# EAGLE design 5VPowerBoard (EAGLE 8.5.0)
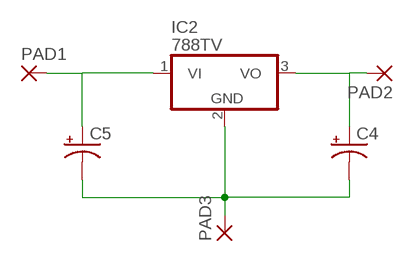
[diagram p0: schematic, sheet 1]

## Parts
C4  CPOL-USE2.5-7  [E2,5-7]
C5  CPOL-USE2.5-7  [E2,5-7]
IC2  788TV  [TO220V]
PAD1  3,81/1,4  [3,81/1,4]
PAD2  3,81/1,4  [3,81/1,4]
PAD3  3,81/1,4  [3,81/1,4]

## Nets
N$1: C4.- C5.- IC2.2(GND) PAD3.1(P)
VDD: C5.+ IC2.1(VI) PAD1.1(P)
VSW: C4.+ IC2.3(VO) PAD2.1(P)

## Library data of the parts
C4 C5 = rcl:CPOL-US: POLARIZED CAPACITOR, American symbol; SPICEPREFIX: C
IC2 = linear:78*: Positive VOLTAGE REGULATOR Source: http://cache.national.com/ds/LM/LM78L05.pdf http://www.fairchildsemi.com/ds/LM/LM7805.pdf
PAD1-PAD3 = wirepad:3,81/1,4: THROUGH-HOLE PAD

## Board
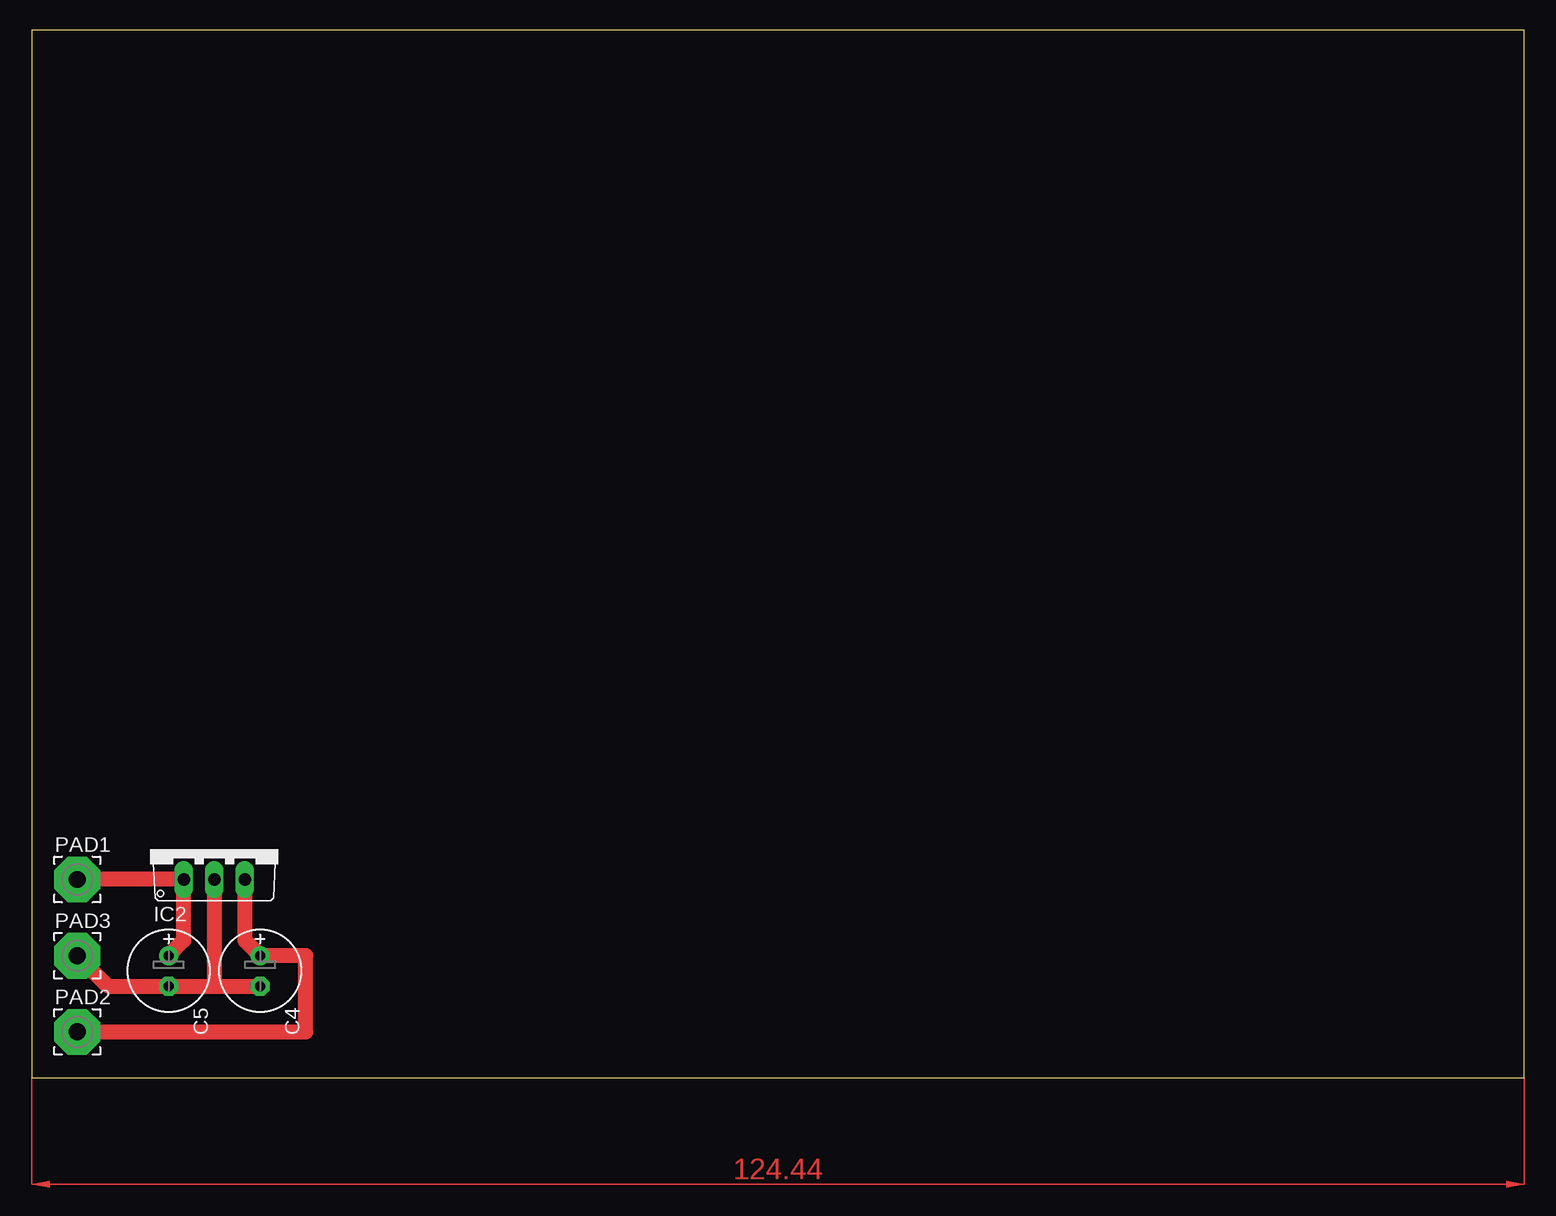
[diagram p1: board, top side]

Size 124.44 x 87.3 mm. Coordinates in mm from the lower left corner, seen from the top.
Outline: 0,0 124.44,0 124.44,87.3 0,87.3 0,0
Copper layers (1*16): Top 0.035mm / dielectric 1.5mm / Bottom 0.035mm
Design rules "default": minimum track width 6mil, minimum drill 0.35mm, track to track 6mil, track to pad 6mil, pad to pad 6mil, via to via 6mil, smd to smd 6mil, copper to edge 40mil, drill to drill 6mil, minimum pad ring 10mil, minimum via ring 8mil, stop-mask expansion 4mil, vias tented up to drill 0mil, thermal gap 10mil

### Footprints (pad centres in the part's own frame; a part is rotated, then mirrored left to right if it is on the bottom)
E2,5-7 = drill 0.813 pad 1.6: + -1.27,0 | drill 0.813 pad 1.6 octagon: - 1.27,0
TO220V = drill 1.016 long: 1 -2.54,-2.54; 2 0,-2.54; 3 2.54,-2.54
3,81/1,4 = drill 1.397 pad 3.81 octagon: 1 0,0

### Placement (x,y rotation side)
C4  19.05,8.89 270 top
C5  11.43,8.89 270 top
IC2  15.24,19.05 0 top
PAD1  3.81,16.51 0 top
PAD2  3.81,3.81 0 top
PAD3  3.81,10.16 0 top

### Tracks (layer width: path | path; a pad name or v marks a point on that pad's centre or on a via)
N$1
  Top 1.27: 15.24,7.62 C5.- 6.35,7.62 PAD3.1 | 15.24,7.62 C4.- | IC2.2 15.24,7.62
VDD
  Top 1.27: PAD1.1 IC2.1 12.7,11.43 C5.+
VSW
  Top 1.27: IC2.3 17.78,11.43 C4.+ 22.86,10.16 22.86,3.81 PAD2.1
(copper drawn outside any net)
  shapes: Top area x1